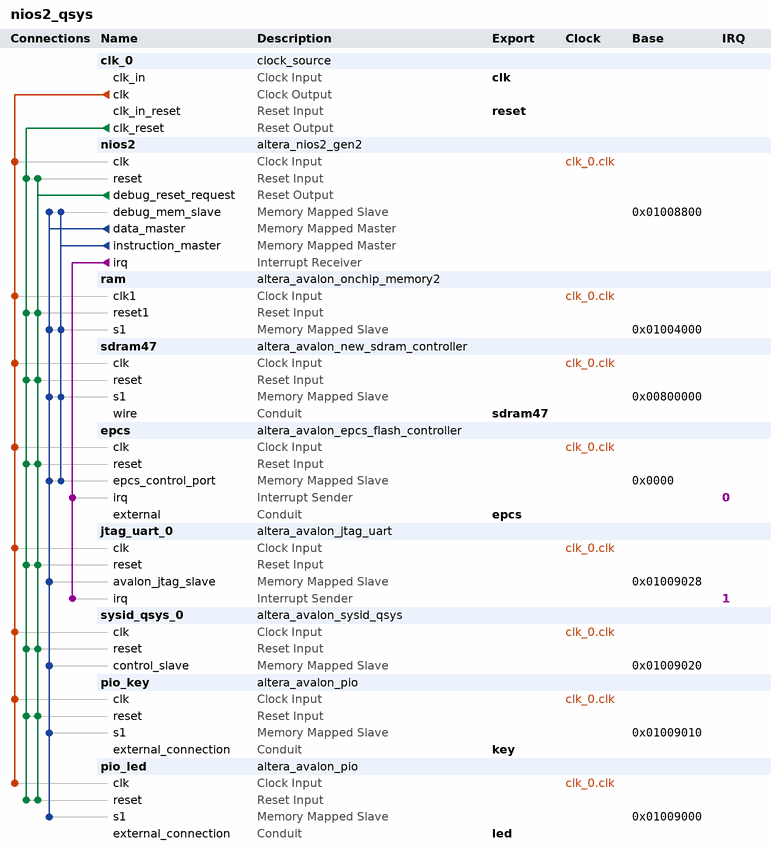
[diagram p0: system contents]
# Platform Designer (Qsys) system nios2_qsys, Cyclone IV E EP4CE15F23C8
# Parameters at their usual value, and those the tool derives, are not listed.
package require -exact qsys 18.1
create_system nios2_qsys
set_project_property DEVICE_FAMILY {Cyclone IV E}
set_project_property DEVICE EP4CE15F23C8

add_instance clk_0 clock_source 18.1
set_instance_parameter_value clk_0 clockFrequency 100000000

add_instance nios2 altera_nios2_gen2 18.1
set_instance_parameter_value nios2 dcache_size 2048
set_instance_parameter_value nios2 exceptionSlave sdram47.s1
set_instance_parameter_value nios2 icache_size 4096
set_instance_parameter_value nios2 impl Fast
set_instance_parameter_value nios2 resetSlave epcs.epcs_control_port

add_instance ram altera_avalon_onchip_memory2 18.1
set_instance_parameter_value ram dataWidth 32
set_instance_parameter_value ram dualPort false
set_instance_parameter_value ram initMemContent true
set_instance_parameter_value ram initializationFileName onchip_mem.hex
set_instance_parameter_value ram memorySize 10240

add_instance sdram47 altera_avalon_new_sdram_controller 18.1
set_instance_parameter_value sdram47 TAC 5.5
set_instance_parameter_value sdram47 TRCD 20.0
set_instance_parameter_value sdram47 TRP 20.0
set_instance_parameter_value sdram47 casLatency 3
set_instance_parameter_value sdram47 columnWidth 8
set_instance_parameter_value sdram47 dataWidth 32
set_instance_parameter_value sdram47 generateSimulationModel false
set_instance_parameter_value sdram47 model single_Micron_MT48LC4M32B2_7_chip
set_instance_parameter_value sdram47 numberOfBanks 4
set_instance_parameter_value sdram47 numberOfChipSelects 1
set_instance_parameter_value sdram47 powerUpDelay 500.0
set_instance_parameter_value sdram47 refreshPeriod 15.625
set_instance_parameter_value sdram47 rowWidth 11

add_instance epcs altera_avalon_epcs_flash_controller 18.1
set_instance_parameter_value epcs resetrequest_enabled true

add_instance jtag_uart_0 altera_avalon_jtag_uart 18.1
set_instance_parameter_value jtag_uart_0 simInteractiveOptions NO_INTERACTIVE_WINDOWS

add_instance sysid_qsys_0 altera_avalon_sysid_qsys 18.1
set_instance_parameter_value sysid_qsys_0 id 0

add_instance pio_key altera_avalon_pio 18.1
set_instance_parameter_value pio_key direction Input
set_instance_parameter_value pio_key width 8

add_instance pio_led altera_avalon_pio 18.1
set_instance_parameter_value pio_led direction Output
set_instance_parameter_value pio_led resetValue 255
set_instance_parameter_value pio_led width 8

# connections
add_connection clk_0.clk epcs.clk clock
add_connection clk_0.clk jtag_uart_0.clk clock
add_connection clk_0.clk nios2.clk clock
add_connection clk_0.clk pio_key.clk clock
add_connection clk_0.clk pio_led.clk clock
add_connection clk_0.clk ram.clk1 clock
add_connection clk_0.clk sdram47.clk clock
add_connection clk_0.clk sysid_qsys_0.clk clock
add_connection clk_0.clk_reset epcs.reset reset
add_connection clk_0.clk_reset jtag_uart_0.reset reset
add_connection clk_0.clk_reset nios2.reset reset
add_connection clk_0.clk_reset pio_key.reset reset
add_connection clk_0.clk_reset pio_led.reset reset
add_connection clk_0.clk_reset ram.reset1 reset
add_connection clk_0.clk_reset sdram47.reset reset
add_connection clk_0.clk_reset sysid_qsys_0.reset reset
add_connection nios2.debug_reset_request epcs.reset reset
add_connection nios2.debug_reset_request jtag_uart_0.reset reset
add_connection nios2.debug_reset_request nios2.reset reset
add_connection nios2.debug_reset_request pio_key.reset reset
add_connection nios2.debug_reset_request pio_led.reset reset
add_connection nios2.debug_reset_request ram.reset1 reset
add_connection nios2.debug_reset_request sdram47.reset reset
add_connection nios2.debug_reset_request sysid_qsys_0.reset reset
add_connection nios2.data_master epcs.epcs_control_port avalon
set_connection_parameter_value nios2.data_master/epcs.epcs_control_port baseAddress 0x0000
add_connection nios2.data_master jtag_uart_0.avalon_jtag_slave avalon
set_connection_parameter_value nios2.data_master/jtag_uart_0.avalon_jtag_slave baseAddress 0x01009028
add_connection nios2.data_master nios2.debug_mem_slave avalon
set_connection_parameter_value nios2.data_master/nios2.debug_mem_slave baseAddress 0x01008800
add_connection nios2.data_master pio_key.s1 avalon
set_connection_parameter_value nios2.data_master/pio_key.s1 baseAddress 0x01009010
add_connection nios2.data_master pio_led.s1 avalon
set_connection_parameter_value nios2.data_master/pio_led.s1 baseAddress 0x01009000
add_connection nios2.data_master ram.s1 avalon
set_connection_parameter_value nios2.data_master/ram.s1 baseAddress 0x01004000
add_connection nios2.data_master sdram47.s1 avalon
set_connection_parameter_value nios2.data_master/sdram47.s1 baseAddress 0x00800000
add_connection nios2.data_master sysid_qsys_0.control_slave avalon
set_connection_parameter_value nios2.data_master/sysid_qsys_0.control_slave baseAddress 0x01009020
add_connection nios2.instruction_master epcs.epcs_control_port avalon
set_connection_parameter_value nios2.instruction_master/epcs.epcs_control_port baseAddress 0x0000
add_connection nios2.instruction_master nios2.debug_mem_slave avalon
set_connection_parameter_value nios2.instruction_master/nios2.debug_mem_slave baseAddress 0x01008800
add_connection nios2.instruction_master ram.s1 avalon
set_connection_parameter_value nios2.instruction_master/ram.s1 baseAddress 0x01004000
add_connection nios2.instruction_master sdram47.s1 avalon
set_connection_parameter_value nios2.instruction_master/sdram47.s1 baseAddress 0x00800000
add_connection nios2.irq epcs.irq interrupt
set_connection_parameter_value nios2.irq/epcs.irq irqNumber 0
add_connection nios2.irq jtag_uart_0.irq interrupt
set_connection_parameter_value nios2.irq/jtag_uart_0.irq irqNumber 1

# exported interfaces
add_interface clk clock sink
set_interface_property clk EXPORT_OF clk_0.clk_in
add_interface epcs conduit end
set_interface_property epcs EXPORT_OF epcs.external
add_interface key conduit end
set_interface_property key EXPORT_OF pio_key.external_connection
add_interface led conduit end
set_interface_property led EXPORT_OF pio_led.external_connection
add_interface reset reset sink
set_interface_property reset EXPORT_OF clk_0.clk_in_reset
add_interface sdram47 conduit end
set_interface_property sdram47 EXPORT_OF sdram47.wire

set_interconnect_requirement {$system} qsys_mm.clockCrossingAdapter HANDSHAKE
set_interconnect_requirement {$system} qsys_mm.enableEccProtection FALSE
set_interconnect_requirement {$system} qsys_mm.insertDefaultSlave FALSE
set_interconnect_requirement {$system} qsys_mm.maxAdditionalLatency 1

save_system nios2_qsys.qsys
